# EAGLE board arduino_olfactometer (EAGLE 5.11)
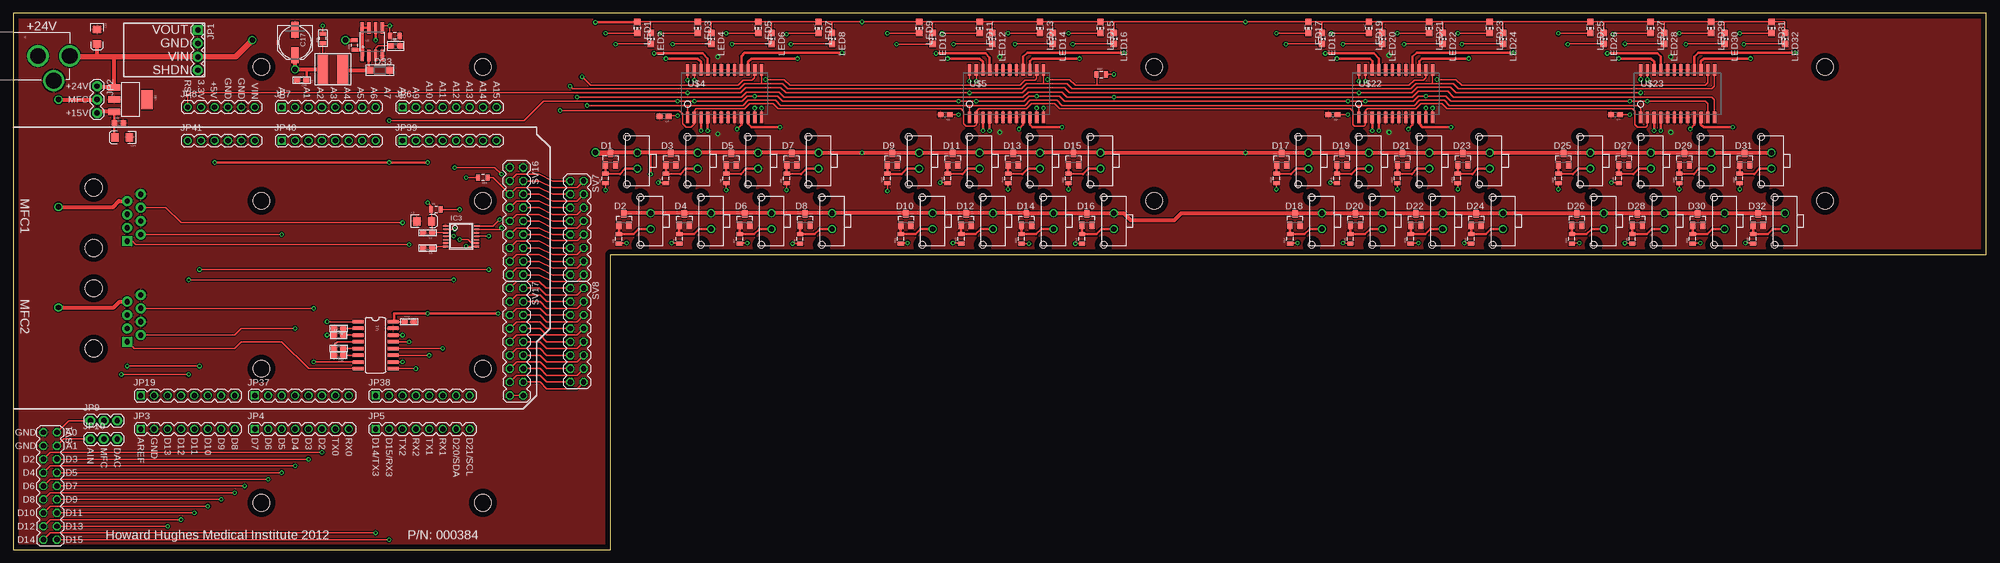
[diagram p4: board, top side]
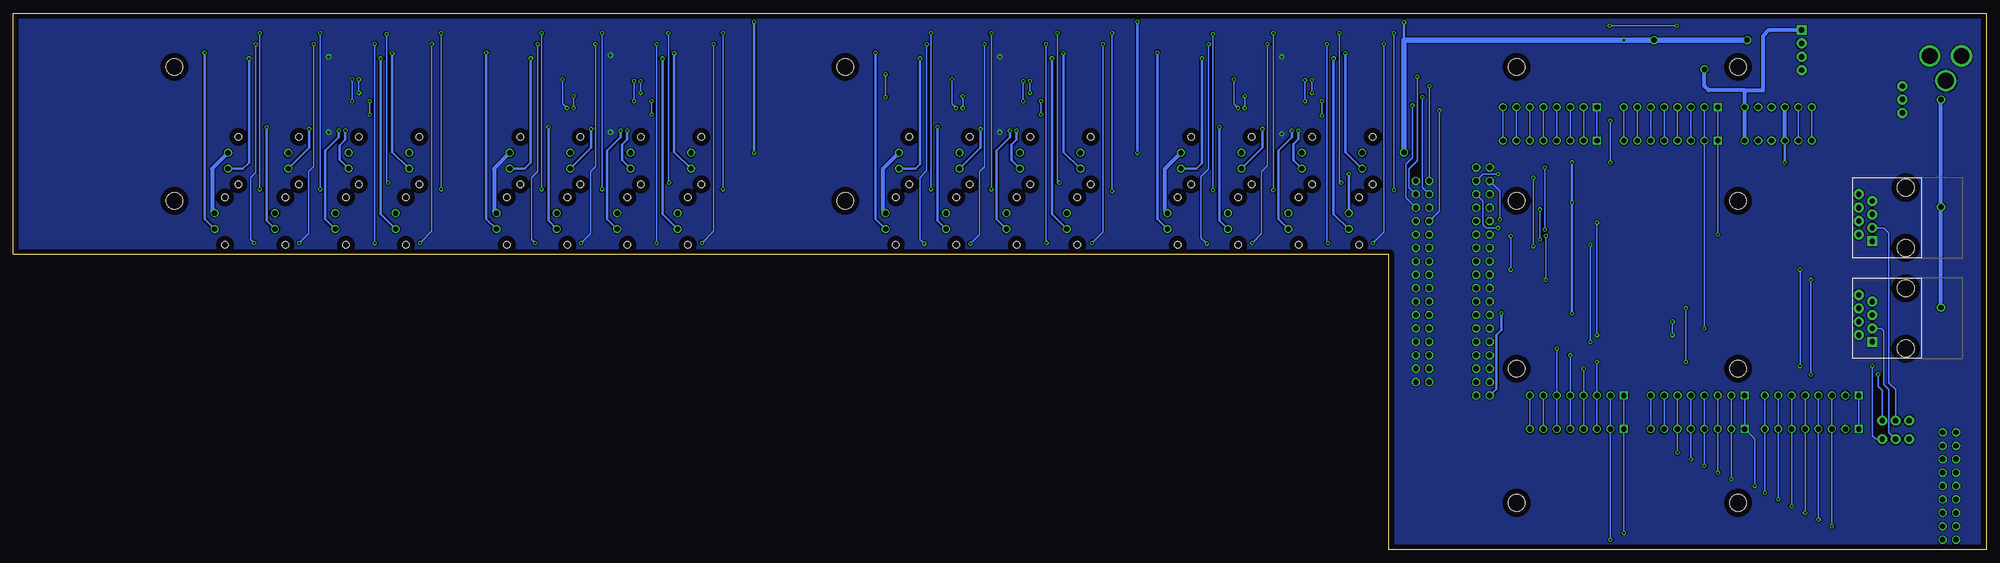
[diagram p5: board, bottom side, seen from below]

Size 373.38 x 101.6 mm. Coordinates in mm from the lower left corner, seen from the top.
Outline: 0,0 113.03,0 113.03,55.88 373.38,55.88 373.38,101.6 0,101.6 0,0
Copper layers (1*16): Top 0.035mm / dielectric 1.5mm / Bottom 0.035mm
Design rules "default *": minimum track width 10mil, minimum drill 13mil, track to track 8mil, track to pad 8mil, pad to pad 8mil, via to via 8mil, smd to smd 8mil, copper to edge 40mil, drill to drill 8mil, minimum pad ring 10mil, minimum via ring 8mil, stop-mask expansion 4mil, vias tented up to drill 0mil, thermal gap 10mil
Holes 3.17 mm at 342.9,91.44 342.9,66.04 215.9,91.44 215.9,66.04 88.9,91.44 88.9,66.04 88.9,34.29 88.9,8.89 46.99,91.44 46.99,66.04 46.99,34.29 46.99,8.89

## Footprints (pad centres in the part's own frame; a part is rotated, then mirrored left to right if it is on the bottom)
0603 = smd 1.1 x 1: 1 -0.85,0; 2 0.85,0
EIA3216 = smd 1.4 x 1.6: A 1.4,0; C -1.4,0
PANASONIC_D = smd 3 x 1.4: + 2.4,0; - -2.4,0
SOT23 = smd 1 x 1.4: 1 -0.95,-1.1; 2 0.95,-1.1; 3 0,1.1
SOD123 = smd 1.4 x 1.4: A 1.9,0; C -1.9,0
TSSOP14 = smd 0.305 x 0.991: 1 -1.95,-2.918; 2 -1.3,-2.918; 3 -0.65,-2.918; 4 0,-2.918; 5 0.65,-2.918; 6 1.3,-2.918; 7 1.95,-2.918; 8 1.95,2.918; 9 1.3,2.918; 10 0.65,2.918; 11 0,2.918; 12 -0.65,2.918; 13 -1.3,2.918; 14 -1.95,2.918
POWER_JACK_PTH = drill 2.997 round: GND 0,7.7; GNDBREAK 4.7,10.7; PWR 0,13.7
1X04 = drill 1.016 pad 1.88 square: 1 0,0 | drill 1.016 pad 1.88 round: 2 2.54,0; 3 5.08,0; 4 7.62,0
1X03 = drill 1.016 pad 1.88 round: 1 0,0; 2 2.54,0; 3 5.08,0
1X08 = drill 1.016 square: 1 0,0 | drill 1.016 round: 2 2.54,0; 3 5.08,0; 4 7.62,0; 5 10.16,0; 6 12.7,0; 7 15.24,0; 8 17.78,0
1X06 = drill 1.016 round: 1 0,0; 2 2.54,0; 3 5.08,0; 4 7.62,0; 5 10.16,0; 6 12.7,0
CR54 = smd 5.5 x 2.15: P$1 0,1.92; P$2 0,-1.92
CHIP-LED0805 = smd 1.2 x 1.2: A 0,-1.05; C 0,1.05
0805 = smd 0.8 x 1.2: 1 -0.9,0; 2 0.9,0
MA09-2 = drill 1.016 octagon: 1 -10.16,-1.27; 2 -10.16,1.27; 3 -7.62,-1.27; 4 -7.62,1.27; 5 -5.08,-1.27; 6 -5.08,1.27; 7 -2.54,-1.27; 8 -2.54,1.27; 9 0,-1.27; 10 0,1.27; 11 2.54,-1.27; 12 2.54,1.27; 13 5.08,-1.27; 14 5.08,1.27; 15 7.62,-1.27; 16 7.62,1.27; 17 10.16,-1.27; 18 10.16,1.27
MA08-2 = drill 1.016 octagon: 1 -8.89,-1.27; 2 -8.89,1.27; 3 -6.35,-1.27; 4 -6.35,1.27; 5 -3.81,-1.27; 6 -3.81,1.27; 7 -1.27,-1.27; 8 -1.27,1.27; 9 1.27,-1.27; 10 1.27,1.27; 11 3.81,-1.27; 12 3.81,1.27; 13 6.35,-1.27; 14 6.35,1.27; 15 8.89,-1.27; 16 8.89,1.27
SO016 = smd 0.66 x 2.032: 1 -4.445,-3.315; 2 -3.175,-3.315; 3 -1.905,-3.315; 4 -0.635,-3.315; 5 0.635,-3.315; 6 1.905,-3.315; 7 3.175,-3.315; 8 4.445,-3.315; 9 4.445,3.315; 10 3.175,3.315; 11 1.905,3.315; 12 0.635,3.315; 13 -0.635,3.315; 14 -1.905,3.315; 15 -3.175,3.315; 16 -4.445,3.315
SO08 = smd 0.61 x 2.21: 1 -1.905,-2.616; 2 -0.635,-2.616; 3 0.635,-2.616; 4 1.905,-2.616; 5 1.905,2.616; 6 0.635,2.616; 7 -0.635,2.616; 8 -1.905,2.616
RJ45-8 = drill 1 pad 1.88 square: 1 -4.445,6.35 | drill 1 pad 1.88 round: 2 -3.175,8.89; 3 -1.905,6.35; 4 -0.635,8.89; 5 0.635,6.35; 6 1.905,8.89; 7 3.175,6.35; 8 4.445,8.89 | hole 3.2: -5.715,0; 5.715,0
SOT223 = smd 1.219 x 2.235: 1 -2.311,-3.099; 2 0,-3.099; 3 2.311,-3.099 | smd 3.6 x 2.2: 4 0,3.099
SOP24 = smd 0.6 x 2.2: 1 -6.985,-4.5; 2 -5.715,-4.5; 3 -4.445,-4.5; 4 -3.175,-4.5; 5 -1.905,-4.5; 6 -0.635,-4.5; 7 0.635,-4.5; 8 1.905,-4.5; 9 3.175,-4.5; 10 4.445,-4.5; 11 5.715,-4.5; 12 6.985,-4.5; 13 6.985,4.5; 14 5.715,4.5; 15 4.445,4.5; 16 3.175,4.5; 17 1.905,4.5; 18 0.635,4.5; 19 -0.635,4.5; 20 -1.905,4.5; 21 -3.175,4.5; 22 -4.445,4.5; 23 -5.715,4.5; 24 -6.985,4.5
MOLEX-MICROFIT-2 = drill 1 round: 1 1.5,0; 2 -1.5,0 | hole 1.27: -4.5,-1.96; 4.5,-1.96

## Placement (x,y rotation side)
C1  .1uF  [0603]  78.42,60.01 180 top
C2  10uF  [EIA3216]  77.79,62.23 0 top
C3  .1uF  [0603]  78.42,57.15 180 top
C4  .1uF  [0603]  123.19,82.07 180 top
C5  .1uF  [0603]  176.37,82.39 180 top
C6  .1uF  [0603]  249.71,82.39 180 top
C7  .1uF  [0603]  303.21,82.39 180 top
C8  1uF  [0603]  61.59,40.64 0 top
C9  1uF  [0603]  61.59,38.1 0 top
C10  1uF  [0603]  61.59,36.83 180 top
C11  1uF  [0603]  61.59,41.91 180 top
C12  1uF  [0603]  74.93,43.18 0 top
C13  10uF  [EIA3216]  15.88,97.16 270 top
C14  10uF  [EIA3216]  20.64,78.11 180 top
C15  1uF  [0603]  20,80.8 0 top
C16  470pF  [0603]  72.39,95.41 0 top
C17  100uF  [PANASONIC_D]  53.34,96.04 270 top
C18  1uF  [0603]  54.61,88.9 180 top
D1  BAT54  [SOT23]  113.03,73.98 0 top
D2  BAT54  [SOT23]  115.57,62.55 0 top
D3  BAT54  [SOT23]  124.46,73.98 0 top
D4  BAT54  [SOT23]  127,62.55 0 top
D5  BAT54  [SOT23]  135.89,73.98 0 top
D6  BAT54  [SOT23]  138.43,62.55 0 top
D7  BAT54  [SOT23]  147.32,73.98 0 top
D8  BAT54  [SOT23]  149.86,62.55 0 top
D9  BAT54  [SOT23]  166.37,73.98 0 top
D10  BAT54  [SOT23]  168.91,62.55 0 top
D11  BAT54  [SOT23]  177.8,73.98 0 top
D12  BAT54  [SOT23]  180.34,62.55 0 top
D13  BAT54  [SOT23]  189.23,73.98 0 top
D14  BAT54  [SOT23]  191.77,62.55 0 top
D15  BAT54  [SOT23]  200.66,73.98 0 top
D16  BAT54  [SOT23]  203.2,62.55 0 top
D17  BAT54  [SOT23]  240.03,73.98 0 top
D18  BAT54  [SOT23]  242.57,62.55 0 top
D19  BAT54  [SOT23]  251.46,73.98 0 top
D20  BAT54  [SOT23]  254,62.55 0 top
D21  BAT54  [SOT23]  262.89,73.98 0 top
D22  BAT54  [SOT23]  265.43,62.55 0 top
D23  BAT54  [SOT23]  274.32,73.98 0 top
D24  BAT54  [SOT23]  276.86,62.55 0 top
D25  BAT54  [SOT23]  293.37,73.98 0 top
D26  BAT54  [SOT23]  295.91,62.55 0 top
D27  BAT54  [SOT23]  304.8,73.98 0 top
D28  BAT54  [SOT23]  307.34,62.55 0 top
D29  BAT54  [SOT23]  316.23,73.98 0 top
D30  BAT54  [SOT23]  318.77,62.55 0 top
D31  BAT54  [SOT23]  327.66,73.98 0 top
D32  BAT54  [SOT23]  330.2,62.55 0 top
D33  [SOD123]  69.37,90.81 0 top
IC3  AD5666  [TSSOP14]  84.77,59.37 270 top
J1  POWER_JACKPTH  [POWER_JACK_PTH]  -3.02,93.5 270 top
JP1  [1X04]  34.93,98.42 270 top
JP2  [1X03]  15.88,87.79 270 top
JP3  [1X08]  24.13,22.86 0 top
JP4  [1X08]  45.72,22.86 0 top
JP5  [1X08]  68.58,22.86 0 top
JP6  [1X08]  73.66,83.82 0 top
JP7  [1X08]  50.8,83.82 0 top
JP8  [1X06]  33.02,83.82 0 top
JP9  [1X03]  14.61,24.45 0 top
JP10  [1X03]  14.61,20.96 0 top
JP19  [1X08]  24.13,29.21 0 top
JP37  [1X08]  45.72,29.21 0 top
JP38  [1X08]  68.58,29.21 0 top
JP39  [1X08]  73.66,77.47 0 top
JP40  [1X08]  50.8,77.47 0 top
JP41  [1X06]  33.02,77.47 0 top
L1  [CR54]  60.48,90.96 90 top
LED1  [CHIP-LED0805]  118.11,98.9 180 top
LED2  [CHIP-LED0805]  120.65,96.84 180 top
LED3  [CHIP-LED0805]  129.54,98.9 180 top
LED4  [CHIP-LED0805]  132.08,96.84 180 top
LED5  [CHIP-LED0805]  140.97,98.9 180 top
LED6  [CHIP-LED0805]  143.51,96.84 180 top
LED7  [CHIP-LED0805]  152.4,98.9 180 top
LED8  [CHIP-LED0805]  154.94,96.84 180 top
LED9  [CHIP-LED0805]  171.45,98.9 180 top
LED10  [CHIP-LED0805]  173.99,96.84 180 top
LED11  [CHIP-LED0805]  182.88,98.9 180 top
LED12  [CHIP-LED0805]  185.26,96.84 180 top
LED13  [CHIP-LED0805]  194.31,98.9 180 top
LED14  [CHIP-LED0805]  196.69,96.84 180 top
LED15  [CHIP-LED0805]  205.74,98.9 180 top
LED16  [CHIP-LED0805]  208.28,96.84 180 top
LED17  [CHIP-LED0805]  245.11,98.9 180 top
LED18  [CHIP-LED0805]  247.65,96.84 180 top
LED19  [CHIP-LED0805]  256.54,98.9 180 top
LED20  [CHIP-LED0805]  259.08,96.84 180 top
LED21  [CHIP-LED0805]  267.97,98.9 180 top
LED22  [CHIP-LED0805]  270.51,96.84 180 top
LED23  [CHIP-LED0805]  279.4,98.9 180 top
LED24  [CHIP-LED0805]  281.94,96.84 180 top
LED25  [CHIP-LED0805]  298.45,98.9 180 top
LED26  [CHIP-LED0805]  300.99,96.84 180 top
LED27  [CHIP-LED0805]  309.88,98.9 180 top
LED28  [CHIP-LED0805]  312.42,96.84 180 top
LED29  [CHIP-LED0805]  321.31,98.9 180 top
LED30  [CHIP-LED0805]  323.85,96.84 180 top
LED31  [CHIP-LED0805]  332.74,98.9 180 top
LED32  [CHIP-LED0805]  335.28,96.84 180 top
R1  10K  [0805]  80.01,64.45 0 top
R2  10K  [0805]  112.08,70.33 90 top
R3  10K  [0805]  114.62,58.9 90 top
R4  10K  [0805]  123.51,70.33 90 top
R5  10K  [0805]  126.05,58.9 90 top
R6  10K  [0805]  134.94,70.33 90 top
R7  10K  [0805]  137.48,58.9 90 top
R8  10K  [0805]  146.37,70.33 90 top
R9  10K  [0805]  148.91,58.9 90 top
R10  10K  [0805]  165.42,70.33 90 top
R11  10K  [0805]  167.96,58.9 90 top
R12  10K  [0805]  176.85,70.33 90 top
R13  10K  [0805]  179.39,58.9 90 top
R14  10K  [0805]  188.28,70.33 90 top
R15  10K  [0805]  190.82,58.9 90 top
R16  10K  [0805]  199.71,70.33 90 top
R17  10K  [0805]  202.25,58.9 90 top
R18  10K  [0805]  239.08,70.33 90 top
R19  10K  [0805]  241.62,58.9 90 top
R20  10K  [0805]  250.51,70.33 90 top
R21  10K  [0805]  253.05,58.9 90 top
R22  10K  [0805]  261.94,70.33 90 top
R23  10K  [0805]  264.48,58.9 90 top
R24  10K  [0805]  273.37,70.33 90 top
R25  10K  [0805]  275.91,58.9 90 top
R26  10K  [0805]  292.42,70.33 90 top
R27  10K  [0805]  294.96,58.9 90 top
R28  10K  [0805]  303.85,70.33 90 top
R29  10K  [0805]  306.39,58.9 90 top
R30  10K  [0805]  315.28,70.33 90 top
R31  10K  [0805]  317.82,58.9 90 top
R32  10K  [0805]  326.71,70.33 90 top
R33  10K  [0805]  329.25,58.9 90 top
R34  0  [0805]  205.9,90.01 0 top
R35  [0805]  64.61,95.57 90 top
R36  1.8K  [0805]  58.58,96.84 90 top
R37  1K  [0805]  72.23,97.31 180 top
R54  0  [0805]  88.9,70.48 180 top
SV1  [MA09-2]  6.99,12.06 270 top
SV7  [MA08-2]  106.68,60.96 270 top
SV8  [MA08-2]  106.68,40.64 270 top
SV16  [MA09-2]  95.25,62.23 270 top
SV17  [MA09-2]  95.25,39.37 270 top
U1  MAX232SOIC16  [SO016]  68.58,38.73 270 top
U2  MC34063SMD  [SO08]  67.95,96.2 0 top
U$1  RJ45-8PTH  [RJ45-8]  15.24,62.86 90 bottom
U$2  RJ45-8PTH  [RJ45-8]  15.24,43.82 90 bottom
U$3  V_REG_MIC2920  [SOT223]  22.23,85.25 270 top
U$4  TLE7232G  [SOP24]  134.62,86.36 0 top
U$5  TLE7232G  [SOP24]  187.96,86.36 0 top
U$6  MOLEX-MICROFIT-2  [MOLEX-MICROFIT-2]  118.11,73.66 270 top
U$7  MOLEX-MICROFIT-2  [MOLEX-MICROFIT-2]  120.65,62.23 270 top
U$8  MOLEX-MICROFIT-2  [MOLEX-MICROFIT-2]  129.54,73.66 270 top
U$9  MOLEX-MICROFIT-2  [MOLEX-MICROFIT-2]  132.08,62.23 270 top
U$10  MOLEX-MICROFIT-2  [MOLEX-MICROFIT-2]  140.97,73.66 270 top
U$11  MOLEX-MICROFIT-2  [MOLEX-MICROFIT-2]  143.51,62.23 270 top
U$12  MOLEX-MICROFIT-2  [MOLEX-MICROFIT-2]  152.4,73.66 270 top
U$13  MOLEX-MICROFIT-2  [MOLEX-MICROFIT-2]  154.94,62.23 270 top
U$14  MOLEX-MICROFIT-2  [MOLEX-MICROFIT-2]  171.45,73.66 270 top
U$15  MOLEX-MICROFIT-2  [MOLEX-MICROFIT-2]  173.99,62.23 270 top
U$16  MOLEX-MICROFIT-2  [MOLEX-MICROFIT-2]  182.88,73.66 270 top
U$17  MOLEX-MICROFIT-2  [MOLEX-MICROFIT-2]  185.42,62.23 270 top
U$18  MOLEX-MICROFIT-2  [MOLEX-MICROFIT-2]  194.31,73.66 270 top
U$19  MOLEX-MICROFIT-2  [MOLEX-MICROFIT-2]  196.85,62.23 270 top
U$20  MOLEX-MICROFIT-2  [MOLEX-MICROFIT-2]  205.74,73.66 270 top
U$21  MOLEX-MICROFIT-2  [MOLEX-MICROFIT-2]  208.28,62.23 270 top
U$22  TLE7232G  [SOP24]  261.62,86.36 0 top
U$23  TLE7232G  [SOP24]  314.96,86.36 0 top
U$24  MOLEX-MICROFIT-2  [MOLEX-MICROFIT-2]  245.11,73.66 270 top
U$25  MOLEX-MICROFIT-2  [MOLEX-MICROFIT-2]  247.65,62.23 270 top
U$26  MOLEX-MICROFIT-2  [MOLEX-MICROFIT-2]  256.54,73.66 270 top
U$27  MOLEX-MICROFIT-2  [MOLEX-MICROFIT-2]  259.08,62.23 270 top
U$28  MOLEX-MICROFIT-2  [MOLEX-MICROFIT-2]  267.97,73.66 270 top
U$29  MOLEX-MICROFIT-2  [MOLEX-MICROFIT-2]  270.51,62.23 270 top
U$30  MOLEX-MICROFIT-2  [MOLEX-MICROFIT-2]  279.4,73.66 270 top
U$31  MOLEX-MICROFIT-2  [MOLEX-MICROFIT-2]  281.94,62.23 270 top
U$32  MOLEX-MICROFIT-2  [MOLEX-MICROFIT-2]  298.45,73.66 270 top
U$33  MOLEX-MICROFIT-2  [MOLEX-MICROFIT-2]  300.99,62.23 270 top
U$34  MOLEX-MICROFIT-2  [MOLEX-MICROFIT-2]  309.88,73.66 270 top
U$35  MOLEX-MICROFIT-2  [MOLEX-MICROFIT-2]  312.42,62.23 270 top
U$36  MOLEX-MICROFIT-2  [MOLEX-MICROFIT-2]  321.31,73.66 270 top
U$37  MOLEX-MICROFIT-2  [MOLEX-MICROFIT-2]  323.85,62.23 270 top
U$38  MOLEX-MICROFIT-2  [MOLEX-MICROFIT-2]  332.74,73.66 270 top
U$39  MOLEX-MICROFIT-2  [MOLEX-MICROFIT-2]  335.28,62.23 270 top

## Tracks (layer width: path | path; a pad name or v marks a point on that pad's centre or on a via)
+3V3
  Bottom 0.254: JP41.2 JP8.2
+5V  (via drill 0.38)
  Top 0.254: v193.68,83.66 U$5.11 | v128.91,88.9 U$4.23 | v140.34,83.66 U$4.11 | v182.25,88.74 U$5.23 | U$23.11 320.68,84.45 320.2,84.93 v309.25,84.93 v305.91,84.93 272.1,84.93 271.14,85.88 v267.33,85.88 265.91,85.88 264.95,84.93 v255.91,84.93 v252.57,84.93 198.91,84.93 197.96,85.88 v193.68,85.88 192.25,85.88 191.29,84.93 v182.25,84.93 v178.91,84.93 145.57,84.93 144.62,85.88 v140.34,85.88 138.91,85.88 137.95,84.93 v128.91,84.93 v125.73,84.93 100.33,84.93 96.68,81.28 v71.12,81.28 | v309.25,89.06 U$23.23 | v255.91,88.74 U$22.23 | v267.33,83.66 U$22.11 | C4.1 124.36,82.23 v125.73,82.23 | C5.1 v178.91,82.39 | v252.57,82.39 C6.1 | v305.91,82.39 C7.1 | SV17.17 SV17.18 | U1.16 C12.1 | IC3.3 79.29,60.02 C1.1 79.27,62.15 C2.A 79.19,64.42 R1.1 79.16,64.98 v78.42,65.72
  Top 0.508: v91.76,44.77 v78.42,44.77 72.07,44.77 72.07,43.36 U1.16 | v38.1,73.34 v71.12,73.34 v78.42,73.34
  Bottom 0.254: v193.68,85.88 v193.68,83.66 | v128.91,84.93 v128.91,88.9 | v140.34,85.88 v140.34,83.66 | v182.25,84.93 v182.25,88.74 | v309.25,84.93 v309.25,89.06 | v255.91,84.93 v255.91,88.74 | v267.33,85.88 v267.33,83.66 | v125.73,84.93 v125.73,82.23 | v178.91,82.39 v178.91,84.93 | v252.57,84.93 v252.57,82.39 | v305.91,84.93 v305.91,82.39 | v71.12,81.28 v71.12,73.34
  Bottom 0.508: SV17.17 92.71,30.48 92.71,40.64 91.76,41.59 v91.76,44.77 | v78.42,73.34 v78.42,65.72 v78.42,44.77 | v38.1,73.34 JP41.3
  Bottom 0.762: JP41.3 JP8.3
+15V
  Top 0.508: U$3.3 19.15,82.91 C15.1 19.15,78.19 C14.A
  Top 0.762: U$3.3 16.1,82.94 JP2.3
AD2
  Bottom 0.254: JP40.3 JP7.3
AD3
  Bottom 0.254: JP40.4 JP7.4
AD4
  Bottom 0.254: JP40.5 JP7.5
AD5
  Bottom 0.254: JP40.6 JP7.6
AD6
  Bottom 0.254: JP40.7 JP7.7
AD7
  Bottom 0.254: JP40.8 JP7.8
AD8
  Bottom 0.254: JP39.1 JP6.1
AD9
  Bottom 0.254: JP39.2 JP6.2
AD10
  Bottom 0.254: JP39.3 JP6.3
AD11
  Bottom 0.254: JP39.4 JP6.4
AD12
  Bottom 0.254: JP39.5 JP6.5
AD13
  Bottom 0.254: JP39.6 JP6.6
AD14
  Bottom 0.254: JP39.7 JP6.7
AD15
  Bottom 0.254: JP39.8 JP6.8
AOUT0  (via drill 0.38)
  Top 0.254: v20.48,33.18 v33.18,33.18 | v33.18,51.12 v83.34,51.12 | v83.34,59.37 IC3.4
  Bottom 0.254: JP9.3 19.68,30.16 20.48,30.96 v20.48,33.18 | v33.18,33.18 v33.18,51.12 | v83.34,51.12 v83.34,59.37
AOUT1  (via drill 0.38)
  Top 0.254: v21.59,34.77 v35.24,34.77 | v35.24,53.02 v90.01,53.02 | v90.01,59.37 IC3.11
  Bottom 0.254: JP10.3 20.95,20.95 21.59,21.59 v21.59,34.77 | v35.24,34.77 v35.24,53.02 | v90.01,53.02 v90.01,59.37
AREF
  Bottom 0.254: JP3.1 JP19.1
D22
  Top 0.254: SV17.15 95.25,33.02 99.69,33.02 100.97,31.75 SV8.15
D23
  Top 0.254: SV17.16 99.69,31.75 100.97,30.48 106.68,30.48 SV8.16
D24
  Top 0.254: SV17.13 95.25,35.56 99.69,35.56 100.97,34.29 SV8.13
D25
  Top 0.254: SV17.14 99.69,34.29 100.97,33.02 106.68,33.02 SV8.14
D26
  Top 0.254: SV17.11 95.25,38.1 99.69,38.1 100.97,36.83 SV8.11
D27
  Top 0.254: SV17.12 99.69,36.83 100.97,35.56 106.68,35.56 SV8.12
D28
  Top 0.254: SV17.9 95.25,40.64 99.69,40.64 100.97,39.37 SV8.9
D29
  Top 0.254: SV17.10 99.69,39.37 100.97,38.1 106.68,38.1 SV8.10
D30
  Top 0.254: SV17.7 95.25,43.18 99.69,43.18 100.97,41.91 SV8.7
D31
  Top 0.254: SV17.8 99.69,41.91 100.97,40.64 106.68,40.64 SV8.8
D32
  Top 0.254: SV17.5 95.25,45.72 99.69,45.72 100.97,44.45 SV8.5
D33
  Top 0.254: SV17.6 99.69,44.45 100.97,43.18 106.68,43.18 SV8.6
D34
  Top 0.254: SV17.3 95.25,48.26 99.69,48.26 100.97,46.99 SV8.3
D35
  Top 0.254: SV17.4 99.69,46.99 100.97,45.72 106.68,45.72 SV8.4
D36
  Top 0.254: SV17.1 95.25,50.8 99.54,50.8 100.81,49.53 SV8.1
D37
  Top 0.254: SV17.2 99.54,49.53 100.81,48.26 106.68,48.26 SV8.2
D38
  Top 0.254: SV16.17 95.25,53.34 99.54,53.34 102.08,52.07 SV7.15
D39
  Top 0.254: SV16.18 99.54,52.07 102.08,50.8 106.68,50.8 SV7.16
D40
  Top 0.254: SV16.15 95.25,55.88 99.54,55.88 102.08,54.61 SV7.13
D41
  Top 0.254: SV16.16 99.54,54.61 102.08,53.34 106.68,53.34 SV7.14
D42
  Top 0.254: SV16.13 95.25,58.42 99.54,58.42 102.08,57.15 SV7.11
D43
  Top 0.254: SV16.14 99.54,57.15 102.08,55.88 106.68,55.88 SV7.12
D44
  Top 0.254: SV16.11 95.25,60.96 99.54,60.96 102.08,59.69 SV7.9
D45
  Top 0.254: SV16.12 99.69,59.69 102.08,58.58 106.84,58.58 SV7.10
D47
  Top 0.254: SV16.10 99.54,62.23 102.08,60.96 106.68,60.96 SV7.8
GND  (via drill 0.51)
  other vias: 133.35,78.74 133.35,93.34 186.69,93.34 186.69,79.06 260.35,79.06 260.35,93.66 313.69,93.34 313.69,79.06
  pour Top: 0,0 0,101.6 373.38,101.6 373.38,55.88 113.03,55.88 113.03,0
  pour Bottom: 0,0 0,101.6 373.38,101.6 373.38,55.88 113.03,55.88 113.03,0
MFC1-AIN
  Bottom 0.254: JP9.2 17.14,30.32 18.41,31.59 18.41,60.01 19.37,60.96 U$1.3
MFC1-AOUT  (via drill 0.38)
  Top 0.254: U$1.2 | U$1.2 v50.8,59.69
  Bottom 0.254: JP7.1 JP40.1 v50.8,59.69
MFC1-RXD  (via drill 0.38)
  Top 0.254: U$1.6 | U$1.6 28.89,64.77 31.75,61.91 v73.66,61.91 | v73.66,40.64 U1.14
  Bottom 0.254: v73.66,61.91 v73.66,40.64
MFC1-TXD  (via drill 0.38)
  Top 0.254: U$1.1 22.54,58.42 23.18,57.78 v74.93,57.78 | v74.93,39.37 U1.13
  Bottom 0.254: v74.93,57.78 v74.93,39.37
MFC2-AIN
  Bottom 0.254: JP10.2 18.41,22.23 18.41,30.32 19.37,31.27 19.37,41.43 19.84,41.91 U$2.3 | U$2.3
MFC2-AOUT  (via drill 0.38)
  Top 0.254: U$2.2 41.91,40.64 43.18,41.91 v53.34,41.91
  Bottom 0.254: JP7.2 JP40.2 v53.34,41.91
MFC2-RXD  (via drill 0.38)
  Top 0.254: U$2.6 | U$2.6 v56.83,45.72 | v56.83,35.56 U1.7
  Bottom 0.254: v56.83,45.72 v56.83,35.56
MFC2-TXD
  Top 0.254: U$2.1 22.86,38.1 41.91,38.1 43.18,39.37 50.8,39.37 55.88,34.29 U1.8
MISO  (via drill 0.38)
  Top 0.254: U$23.12 321.94,85.25 321.47,85.72 272.57,85.72 271.46,86.84 265.91,86.84 264.8,85.72 v208.28,85.72 199.39,85.72 198.44,86.68 192.09,86.68 191.13,85.72 145.89,85.72 144.94,86.68 138.75,86.68 137.79,85.72 v106.68,85.72 | v208.28,90.01 R34.2 | SV7.3 102.08,67.31 99.54,68.58 95.25,68.58 SV16.5 90.81,70.48 R54.1
  Bottom 0.254: v208.28,85.72 v208.28,90.01 | SV7.3 106.68,68.58 v106.68,85.72
MOSI  (via drill 0.38)
  Top 0.254: U$4.14 140.34,89.38 139.86,88.9 138.11,88.9 137.16,87.95 109.22,87.95 v107.63,89.53 | SV16.6 99.54,67.31 102.08,66.04 106.68,66.04 SV7.4 | v92.39,60.96 92.11,60.67 IC3.13
  Bottom 0.254: SV16.6 95.25,66.04 95.25,61.59 94.61,60.96 v92.39,60.96 | v107.63,89.53 107.63,73.66 109.22,72.07 109.22,68.58 SV7.4
N$1  (via drill 0.38)
  Top 0.254: R1.2 v84.45,64.45 | v84.45,58.74 86.04,58.74 86.71,58.07 IC3.9
  Bottom 0.254: v84.45,64.45 v84.45,58.74
N$2
  Top 0.254: C8.2 U1.3
N$3  (via drill 0.38)
  Top 0.254: v141.6,83.66 U$4.12 | v142.4,89.06 145.89,89.06 147,87.95 190.5,87.95 191.45,88.9 193.36,88.9 193.68,89.22 U$5.14
  Bottom 0.254: v141.6,83.66 142.4,84.45 v142.4,89.06
N$4  (via drill 0.38)
  Top 0.508: D1.1 R2.2 114.83,71.18 115.82,72.16 U$6.1 | v121.28,93.98 130.49,93.98 131.44,93.03 U$4.21
  Bottom 0.508: U$6.1 121.28,75.33 v121.28,93.98
N$5  (via drill 0.38)
  Top 0.254: v112.08,68.1 R2.1 | v112.08,97.79 112.14,97.85 LED1.C
  Bottom 0.254: v112.08,68.1 v112.08,97.79
N$6  (via drill 0.38)
  Top 0.508: D2.1 R3.2 117.37,59.75 118.36,60.73 U$7.1 | v123.51,93.03 129.54,93.03 130.18,92.39 U$4.22
  Bottom 0.508: U$7.1 123.51,63.59 v123.51,93.03
N$7  (via drill 0.38)
  Top 0.508: D3.1 R4.2 126.26,71.18 127.25,72.16 U$8.1 | v130.18,79.38 U$4.3
  Bottom 0.508: U$8.1 131.13,73.75 131.13,76.83 130.18,77.79 v130.18,79.38
N$8
  Top 0.254: IC3.7 80.28,57.42 80.01,57.15 C3.1
N$9  (via drill 0.38)
  Top 0.254: R3.1 114.67,58.1 v116.05,58.1 | v113.98,95.73 114.04,95.79 LED2.C
  Bottom 0.254: v116.05,58.1 113.98,60.17 v113.98,95.73
N$10  (via drill 0.38)
  Top 0.254: R4.1 123.45,69.53 v122.08,69.53 | v122.4,97.79 122.46,97.85 LED3.C
  Bottom 0.254: v122.08,69.53 122.4,69.85 v122.4,97.79
N$11  (via drill 0.38)
  Top 0.254: R5.1 125.99,58.1 v124.62,58.1 | v124.78,95.73 124.84,95.79 LED4.C
  Bottom 0.254: v124.62,58.1 124.78,58.26 v124.78,95.73
N$12  (via drill 0.38)
  Top 0.254: v134.94,97.79 135,97.85 LED5.C | v134.94,68.1 R6.1
  Bottom 0.254: v134.94,68.1 v134.94,97.79
N$13  (via drill 0.38)
  Top 0.254: R7.1 137.53,58.1 v138.91,58.1 | v136.05,95.73 136.11,95.79 LED6.C
  Bottom 0.254: v138.91,58.1 137.16,59.85 137.16,71.6 136.05,72.71 v136.05,95.73
N$14  (via drill 0.38)
  Top 0.508: D4.1 R5.2 128.8,59.75 129.79,60.73 U$9.1 | v131.44,79.38 U$4.4
  Bottom 0.508: U$9.1 133.99,62.63 133.99,75.56 131.44,78.11 v131.44,79.38
N$15  (via drill 0.38)
  Top 0.508: D5.1 R6.2 137.69,71.18 138.68,72.16 U$10.1 | v137,79.69 137.79,80.49 U$4.9
  Bottom 0.508: U$10.1 137,76.13 v137,79.69
N$16  (via drill 0.38)
  Top 0.508: D6.1 R7.2 140.23,59.75 141.22,60.73 U$11.1 | v145.1,80.01 139.7,80.01 139.06,80.64 U$4.10
  Bottom 0.508: U$11.1 145.1,62.32 v145.1,80.01
N$17  (via drill 0.38)
  Top 0.254: v146.37,97.63 146.59,97.85 LED7.C | v146.37,68.1 R8.1
  Bottom 0.254: v146.37,68.1 v146.37,97.63
N$18  (via drill 0.38)
  Top 0.254: R9.1 148.81,57.94 v147.48,57.94 | v147.16,95.73 147.22,95.79 LED8.C
  Bottom 0.254: v147.48,57.94 148.59,59.05 148.59,70.64 147.16,72.07 v147.16,95.73
N$19  (via drill 0.38)
  Top 0.508: D7.1 R8.2 149.12,71.18 150.11,72.16 U$12.1 | v148.43,93.03 139.7,93.03 139.06,92.39 U$4.15
  Bottom 0.508: U$12.1 149.46,72.16 148.43,73.18 v148.43,93.03
N$20  (via drill 0.38)
  Top 0.508: D8.1 R9.2 151.66,59.75 152.65,60.73 U$13.1 | U$4.16 137.79,93.5 138.43,94.14 v156.84,94.14
  Bottom 0.508: v156.84,94.14 156.84,62.63 U$13.1
N$21  (via drill 0.38)
  Top 0.254: U$22.12 v268.61,83.66 | v269.4,89.06 273.05,89.06 274.16,87.95 320.2,87.95 320.68,88.42 U$23.14
  Bottom 0.254: v268.61,83.66 269.4,84.45 v269.4,89.06
N$22  (via drill 0.38)
  Top 0.508: D9.1 R10.2 165.42,71.12 168.12,71.12 169.16,72.16 U$14.1 | v174.62,93.98 183.99,93.98 184.78,93.19 U$5.21
  Bottom 0.508: U$14.1 174.62,75.33 v174.62,93.98
N$23  (via drill 0.38)
  Top 0.508: U$15.1 171.7,60.73 170.71,59.75 R11.2 D10.1 | v176.85,93.03 182.88,93.03 183.51,92.39 U$5.22
  Bottom 0.508: U$15.1 176.85,63.59 v176.85,93.03
N$24  (via drill 0.38)
  Top 0.508: D11.1 R12.2 179.6,71.18 180.59,72.16 U$16.1 | v183.51,79.38 U$5.3
  Bottom 0.508: U$16.1 184.47,73.75 184.47,76.68 183.51,77.63 v183.51,79.38
N$25  (via drill 0.38)
  Top 0.254: v165.42,67.94 R10.1 | v165.42,97.79 165.42,97.85 LED9.C
  Bottom 0.254: v165.42,97.79 v165.42,67.94
N$26  (via drill 0.38)
  Top 0.254: R11.1 167.96,58.1 v169.23,58.1 | v167.16,95.73 173.93,95.73 LED10.C
  Bottom 0.254: v169.23,58.1 167.16,60.17 v167.16,95.73
N$27  (via drill 0.38)
  Top 0.254: R12.1 176.85,69.53 v175.42,69.53 | v175.74,97.79 175.8,97.85 LED11.C
  Bottom 0.254: v175.42,69.53 175.74,69.85 v175.74,97.79
N$28  (via drill 0.38)
  Top 0.254: R13.1 179.33,58.1 v177.8,58.1 | v177.96,95.73 178.02,95.79 LED12.C
  Bottom 0.254: v177.8,58.1 177.96,58.26 v177.96,95.73
N$29  (via drill 0.38)
  Top 0.254: v188.28,97.79 188.34,97.85 LED13.C | v188.28,68.26 R14.1
  Bottom 0.254: v188.28,68.26 v188.28,97.79
N$30  (via drill 0.38)
  Top 0.254: R15.1 190.92,57.94 v192.25,57.94 | v189.55,95.73 189.61,95.79 LED14.C
  Bottom 0.254: v192.25,57.94 190.5,59.69 190.5,71.6 189.55,72.55 v189.55,95.73
N$31  (via drill 0.38)
  Top 0.508: U$17.1 183.13,60.73 182.14,59.75 R13.2 D12.1 | v184.78,79.38 U$5.4
  Bottom 0.508: U$17.1 187.32,62.63 187.32,75.56 184.78,78.11 v184.78,79.38
N$32  (via drill 0.38)
  Top 0.508: U$18.1 192.02,72.16 191.03,71.18 R14.2 D13.1 | v190.34,79.69 191.13,80.49 U$5.9
  Bottom 0.508: U$18.1 190.34,76.13 v190.34,79.69
N$33  (via drill 0.38)
  Top 0.508: U$19.1 194.56,60.73 193.57,59.75 R15.2 D14.1 | v198.44,80.01 192.88,80.01 192.41,80.49 U$5.10
  Bottom 0.508: U$19.1 198.44,62.32 v198.44,80.01
N$34  (via drill 0.38)
  Top 0.254: R16.1 199.71,69.48 v199.71,68.26 | v199.71,97.79 199.71,97.85 LED15.C
  Bottom 0.254: v199.71,68.26 v199.71,97.79
N$35  (via drill 0.38)
  Top 0.254: R17.1 202.25,57.94 v200.98,57.94 | v200.5,95.73 200.56,95.79 LED16.C
  Bottom 0.254: v200.98,57.94 201.77,58.74 201.77,70.48 200.5,71.75 v200.5,95.73
N$36  (via drill 0.38)
  Top 0.508: U$20.1 203.45,72.16 202.46,71.18 R16.2 D15.1 | v201.77,93.03 192.88,93.03 192.41,92.55 U$5.15
  Bottom 0.508: v201.77,93.03 201.77,73.03 202.64,72.16 U$20.1
N$37  (via drill 0.38)
  Top 0.508: U$21.1 205.99,60.73 205,59.75 R17.2 D16.1 | v210.19,94.14 191.93,94.14 191.13,93.34 U$5.16
  Bottom 0.508: U$21.1 210.19,62.63 v210.19,94.14
N$38  (via drill 0.38)
  Top 0.508: D17.1 R18.2 241.83,71.18 242.82,72.16 U$24.1 | v248.28,93.98 257.49,93.98 258.44,93.03 U$22.21
  Bottom 0.508: U$24.1 248.28,75.33 v248.28,93.98
N$39  (via drill 0.38)
  Top 0.508: D18.1 R19.2 244.37,59.75 245.36,60.73 U$25.1 | v250.51,93.03 256.7,93.03 257.18,92.55 U$22.22
  Bottom 0.508: U$25.1 250.51,63.59 v250.51,93.03
N$40  (via drill 0.38)
  Top 0.508: D19.1 250.51,71.18 R20.2 253.26,71.18 254.25,72.16 U$26.1 | v257.18,79.38 U$22.3
  Bottom 0.508: U$26.1 258.13,73.75 258.13,76.68 257.18,77.63 v257.18,79.38
N$41  (via drill 0.38)
  Top 0.254: v239.08,68.26 R18.1 | v239.08,97.79 239.14,97.85 LED17.C
  Bottom 0.254: v239.08,68.26 v239.08,97.79
N$42  (via drill 0.38)
  Top 0.254: R19.1 241.62,58.1 v243.05,58.1 | v240.82,95.73 240.82,95.79 LED18.C
  Bottom 0.254: v243.05,58.1 240.82,60.33 v240.82,95.73
N$43  (via drill 0.38)
  Top 0.254: R20.1 250.51,69.53 v249.24,69.53 | v249.4,97.79 249.4,97.85 LED19.C
  Bottom 0.254: v249.24,69.53 249.4,69.69 v249.4,97.79
N$44  (via drill 0.38)
  Top 0.254: R21.1 251.62,58.05 v251.62,58.1 | v251.62,95.73 251.62,95.79 LED20.C
  Bottom 0.254: v251.62,58.1 v251.62,95.73
N$45  (via drill 0.38)
  Top 0.254: 261.94,69.53 R22.1 v261.94,68.26 | v261.94,97.79 261.94,97.85 LED21.C
  Bottom 0.254: v261.94,68.26 v261.94,97.79
N$46  (via drill 0.38)
  Top 0.254: R23.1 264.48,58.1 v265.91,58.1 | v263.21,95.73 263.21,95.79 LED22.C
  Bottom 0.254: v265.91,58.1 264.16,59.85 264.16,71.6 263.21,72.55 v263.21,95.73
N$47  (via drill 0.38)
  Top 0.508: D20.1 R21.2 255.8,59.75 256.79,60.73 U$27.1 | v258.44,79.38 U$22.4
  Bottom 0.508: U$27.1 260.99,62.63 260.99,75.56 258.44,78.11 v258.44,79.38
N$48  (via drill 0.38)
  Top 0.508: D21.1 261.94,71.18 R22.2 264.69,71.18 265.68,72.16 U$28.1 | v264,79.69 264.8,80.49 U$22.9
  Bottom 0.508: v264,79.69 264,76.12 264.01,76.12 U$28.1
N$49  (via drill 0.38)
  Top 0.508: D22.1 R23.2 267.23,59.75 268.22,60.73 U$29.1 | v272.1,80.01 266.7,80.01 266.06,80.64 U$22.10
  Bottom 0.508: U$29.1 272.1,62.32 v272.1,80.01
N$50  (via drill 0.38)
  Top 0.254: v273.37,68.26 R24.1 | v273.37,97.79 273.37,97.85 LED23.C
  Bottom 0.254: v273.37,68.26 v273.37,97.79
N$51  (via drill 0.38)
  Top 0.254: R25.1 275.91,58.1 v274.64,58.1 | v274.16,95.73 274.16,95.79 LED24.C
  Bottom 0.254: v274.64,58.1 275.27,58.74 275.27,70.48 274.16,71.6 v274.16,95.73
N$52  (via drill 0.38)
  Top 0.508: D23.1 273.37,71.18 R24.2 276.12,71.18 277.11,72.16 U$30.1 | v275.43,93.03 266.54,93.03 266.06,92.55 U$22.15
  Bottom 0.508: U$30.1 276.61,72.16 275.43,73.34 v275.43,93.03
N$53  (via drill 0.38)
  Top 0.508: U$31.1 279.65,60.73 278.66,59.75 R25.2 275.91,59.75 D24.1 | v283.85,94.14 265.59,94.14 264.8,93.34 U$22.16
  Bottom 0.508: U$31.1 283.85,62.63 v283.85,94.14
N$54  (via drill 0.38)
  Top 0.508: D25.1 292.42,71.18 R26.2 295.17,71.18 296.16,72.16 U$32.1 | v301.62,93.98 311.15,93.98 311.79,93.34 U$23.21
  Bottom 0.508: U$32.1 301.62,75.33 v301.62,93.98
N$55  (via drill 0.38)
  Top 0.508: D26.1 294.96,59.75 R27.2 297.71,59.75 298.7,60.73 U$33.1 | v303.85,93.03 309.88,93.03 310.51,92.39 U$23.22
  Bottom 0.508: U$33.1 303.85,63.59 v303.85,93.03
N$56  (via drill 0.38)
  Top 0.508: D27.1 303.85,71.18 R28.2 306.6,71.18 307.59,72.16 U$34.1 | v310.51,79.38 U$23.3
  Bottom 0.508: U$34.1 311.63,73.91 311.63,76.52 310.51,77.63 v310.51,79.38
N$57  (via drill 0.38)
  Top 0.254: v292.42,68.26 R26.1 | v292.42,97.79 292.42,97.85 LED25.C
  Bottom 0.254: v292.42,68.26 v292.42,97.79
N$58  (via drill 0.38)
  Top 0.254: R27.1 294.96,58.1 v296.39,58.1 | v294.16,95.73 294.16,95.79 LED26.C
  Bottom 0.254: v296.39,58.1 294.16,60.33 v294.16,95.73
N$59  (via drill 0.38)
  Top 0.254: R28.1 303.85,69.53 v302.42,69.53 | v302.74,97.63 302.74,97.85 LED27.C
  Bottom 0.254: v302.42,69.53 302.74,69.85 v302.74,97.63
N$60  (via drill 0.38)
  Top 0.254: R29.1 v304.96,58.05 | v304.96,95.79 LED28.C
  Bottom 0.254: v304.96,58.05 v304.96,95.79
N$61  (via drill 0.38)
  Top 0.254: 315.28,69.53 R30.1 v315.28,68.26 | v315.28,97.79 315.28,97.85 LED29.C
  Bottom 0.254: v315.28,68.26 v315.28,97.79
N$62  (via drill 0.38)
  Top 0.254: R31.1 317.82,58.1 v319.25,58.1 | v316.55,95.73 316.55,95.79 LED30.C
  Bottom 0.254: v319.25,58.1 317.5,59.85 317.5,71.6 316.55,72.55 v316.55,95.73
N$63  (via drill 0.38)
  Top 0.508: D28.1 306.39,59.75 R29.2 309.14,59.75 310.13,60.73 U$35.1 | v311.79,79.38 U$23.4
  Bottom 0.508: U$35.1 314.32,62.63 314.32,75.56 311.79,78.11 v311.79,79.38
N$64  (via drill 0.38)
  Top 0.508: D29.1 315.28,71.18 R30.2 318.03,71.18 319.02,72.16 U$36.1 | v317.34,79.69 318.13,80.49 U$23.9
  Bottom 0.508: U$36.1 317.34,76.13 v317.34,79.69
N$65  (via drill 0.38)
  Top 0.508: D30.1 317.82,59.75 R31.2 320.57,59.75 321.56,60.73 U$37.1 | v325.44,80.01 319.88,80.01 319.4,80.49 U$23.10
  Bottom 0.508: U$37.1 325.44,62.32 v325.44,80.01
N$66  (via drill 0.38)
  Top 0.254: v326.71,68.26 R32.1 | v326.71,97.79 326.71,97.85 LED31.C
  Bottom 0.254: v326.71,68.26 v326.71,97.79
N$67  (via drill 0.38)
  Top 0.254: R33.1 329.25,58.1 v327.82,58.1 | v327.5,95.73 327.5,95.79 LED32.C
  Bottom 0.254: v327.82,58.1 328.45,58.74 328.45,70.48 327.5,71.44 v327.5,95.73
N$68  (via drill 0.38)
  Top 0.508: D31.1 326.71,71.18 R32.2 329.46,71.18 330.45,72.16 U$38.1 | v328.77,93.03 319.88,93.03 319.4,92.55 U$23.15
  Bottom 0.508: U$38.1 329.95,72.16 328.77,73.34 v328.77,93.03
N$69  (via drill 0.38)
  Top 0.508: D32.1 329.25,59.75 R33.2 332,59.75 332.99,60.73 U$39.1 | v337.19,94.14 318.93,94.14 318.13,93.34 U$23.16
  Bottom 0.508: U$39.1 337.19,62.63 v337.19,94.14
N$70  (via drill 0.38)
  Top 0.254: C8.1 v59.37,40.64 | v59.37,43.18 U1.1
  Bottom 0.254: v59.37,40.64 v59.37,43.18
N$71
  Top 0.254: C9.1 60.74,38.84 61.28,39.37 U1.4
N$72
  Top 0.254: C9.2 U1.5
N$73
  Top 0.254: C11.1 U1.2
N$74
  Top 0.254: C10.1 U1.6
N$76
  Top 0.254: SV1.2 10.48,24.45 JP9.1
N$77
  Top 0.254: SV1.4 9.53,20.95 JP10.1
N$78
  Top 0.508: U2.8 U2.7 | 65.93,94.67 66.04,94.77
  Top 0.762: U2.1 66.04,94.77 U2.8 | R35.1 65.93,94.67
N$81
  Top 0.508: U2.2 67.31,90.97 D33.C
  Top 0.762: D33.C 62.56,90.81 L1.P$2
N$82
  Top 0.254: U2.3 68.58,94.93 68.9,95.25 69.06,95.41 C16.1 | C16.1
N$83  (via drill 0.38)
  Top 0.254: R36.2 v58.58,99.22 | R37.2 71.28,97.37 v71.28,99.22 69.85,99.22 U2.5
  Bottom 0.254: v58.58,99.22 v71.28,99.22
N$158  (via drill 0.38)
  Top 0.254: IC3.8 86.09,57.42 v85.72,57.47 | v85.72,70.48 R54.2
  Bottom 0.254: v85.72,57.47 v85.72,70.48
NRST  (via drill 0.38)
  Top 0.254: v180.97,88.74 U$5.24 | v127.64,88.9 U$4.24 | v307.98,86.52 273.05,86.52 271.94,87.63 265.75,87.63 264.64,86.52 v254.63,86.52 199.87,86.52 198.91,87.47 191.93,87.47 190.98,86.52 v180.97,86.52 146.21,86.52 145.26,87.47 138.59,87.47 137.64,86.52 v127.64,86.52 100.33,86.52 33.5,86.52 33.02,86.04 JP8.1 | v307.98,89.06 U$23.24 | v254.63,88.74 U$22.24
  Bottom 0.254: v180.97,86.52 v180.97,88.74 | v127.64,86.52 v127.64,88.9 | v307.98,86.52 v307.98,89.06 | v254.63,86.52 v254.63,88.74 | JP8.1 JP41.1
PWM2  (via drill 0.38)
  Top 0.254: SV1.5 6.99,18.41 v58.42,18.41
  Bottom 0.254: JP37.6 JP4.6 v58.42,18.41
PWM3  (via drill 0.38)
  Top 0.254: SV1.6 v55.88,17.14
  Bottom 0.254: JP37.5 JP4.5 v55.88,17.14
PWM4  (via drill 0.38)
  Top 0.254: SV1.7 6.99,15.88 v53.34,15.88
  Bottom 0.254: JP37.4 JP4.4 v53.34,15.88
PWM5  (via drill 0.38)
  Top 0.254: SV1.8 v50.8,14.61
  Bottom 0.254: JP37.3 JP4.3 v50.8,14.61
PWM6  (via drill 0.38)
  Top 0.254: SV1.9 6.99,13.34 v48.26,13.34
  Bottom 0.254: JP37.2 JP4.2 v48.26,13.34
PWM7  (via drill 0.38)
  Top 0.254: SV1.10 v43.81,12.06
  Bottom 0.254: JP37.1 JP4.1 43.81,20.95 v43.81,12.06
PWM8  (via drill 0.38)
  Top 0.254: SV1.11 6.99,10.79 v41.91,10.79
  Bottom 0.254: JP19.8 JP3.8 v41.91,10.79
PWM9  (via drill 0.38)
  Top 0.254: SV1.12 v39.37,9.53
  Bottom 0.254: JP19.7 JP3.7 v39.37,9.53
PWM10  (via drill 0.38)
  Top 0.254: SV1.13 6.99,8.26 v36.83,8.26
  Bottom 0.254: JP19.6 JP3.6 v36.83,8.26
PWM11  (via drill 0.38)
  Top 0.254: SV1.14 v34.29,6.99
  Bottom 0.254: JP19.5 JP3.5 v34.29,6.99
PWM12  (via drill 0.38)
  Top 0.254: SV1.15 6.99,5.71 v31.75,5.71
  Bottom 0.254: JP19.4 JP3.4 v31.75,5.71
PWM13  (via drill 0.38)
  Top 0.254: SV1.16 v29.21,4.45
  Bottom 0.254: JP19.3 JP3.3 v29.21,4.45
RX0
  Bottom 0.254: JP4.8 JP37.8
RX1  (via drill 0.38)
  Top 0.254: v81.28,38.1 U1.12
  Bottom 0.254: JP5.6 JP38.6 v81.28,38.1
RX2  (via drill 0.38)
  Top 0.254: v76.2,34.29 U1.9
  Bottom 0.254: JP5.4 JP38.4 v76.2,34.29
RX3  (via drill 0.38)
  Top 0.254: SV1.18 v71.12,1.91
  Bottom 0.254: JP38.2 JP5.2 v71.12,1.91
SCK  (via drill 0.38)
  Top 0.254: 141.6,88.27 145.57,88.27 146.53,87.31 190.82,87.31 191.77,88.27 194.94,88.27 | 141.6,88.27 138.43,88.27 137.48,87.31 105.89,87.31 v105.41,87.79 | 141.6,88.27 U$4.13 | 194.94,88.27 U$5.13 | 268.61,88.27 U$22.13 | 268.61,88.27 265.43,88.27 264.48,87.31 200.34,87.31 199.39,88.27 194.94,88.27 | 268.61,88.27 272.57,88.27 273.53,87.31 321.47,87.31 321.94,87.79 U$23.13 | SV16.3 95.25,71.12 99.54,71.12 102.08,69.85 SV7.1 | IC3.14 90.85,61.32 v92.08,62.55
  Bottom 0.254: v92.08,62.55 92.08,67.94 SV16.3 | v105.41,87.79 SV7.1
SCL
  Bottom 0.254: JP5.8 JP38.8
SDA
  Bottom 0.254: JP5.7 JP38.7
SO2  (via drill 0.38)
  Top 0.254: U$5.12 v194.94,83.66 | v195.74,89.06 199.87,89.06 200.98,87.95 205.1,87.95 | 205.1,87.95 264.16,87.95 265.11,88.9 266.86,88.9 267.33,89.38 U$22.14 | R34.1 205.1,89.95 205.1,87.95
  Bottom 0.254: v194.94,83.66 195.74,84.45 v195.74,89.06
SPI-CS2
  Top 0.254: SV16.7 95.25,66.04 99.54,66.04 102.08,64.77 SV7.5
SS  (via drill 0.38)
  Top 0.254: SV16.4 99.54,69.85 102.08,68.58 106.68,68.58 SV7.2 | v92.39,71.12 91.12,72.39 v83.5,72.39 | v83.5,60.64 83.47,60.67 IC3.2
  Bottom 0.254: SV16.4 95.25,71.12 v92.39,71.12 | v83.5,60.64 v83.5,72.39
TX0
  Bottom 0.254: JP4.7 JP37.7
TX1  (via drill 0.38)
  Top 0.254: v78.74,36.83 U1.11
  Bottom 0.254: JP5.5 JP38.5 v78.74,36.83
TX2  (via drill 0.38)
  Top 0.254: v73.66,35.56 U1.10
  Bottom 0.254: JP5.3 JP38.3 v73.66,35.56
TX3  (via drill 0.38)
  Top 0.254: SV1.17 6.99,3.17 v68.58,3.17
  Bottom 0.254: JP38.1 JP5.1 v68.58,3.17
V-MFC  (via drill 1.02)
  Top 0.762: U$2.7 20.16,46.99 19.05,45.88 v8.57,45.88 | v8.57,85.25 JP2.2 | U$1.7 | U$1.7 20,66.04 18.89,64.93 v8.57,64.93
  Bottom 0.762: v8.57,45.88 v8.57,64.93 v8.57,85.25
VADR  (via drill 1.02)
  Top 0.254: R36.1 58.58,90.98 L1.P$1
  Top 0.508: C18.1 55.56,88.9 55.56,90.96
  Top 0.762: C17.+ v53.34,90.96 55.56,90.96 L1.P$1
  Bottom 0.762: JP41.6 JP8.6 45.72,87 | JP1.1 41.12,98.42 42.23,97.31 42.23,87 45.72,87 | v53.34,90.96 53.34,87.79 52.55,87 45.72,87
VD_CS  (via drill 0.38)
  Top 0.254: 127.64,84.14 U$4.1 | 127.64,84.14 v108.58,84.14 | 180.97,84.14 145.26,84.14 144.3,85.09 139.06,85.09 138.11,84.14 127.64,84.14 | U$5.1 180.97,84.14 | 180.97,84.14 | 180.97,84.14 191.45,84.14 192.41,85.09 197.49,85.09 198.44,84.14 254.63,84.14 | 254.63,84.14 U$22.1 | 254.63,84.14 265.11,84.14 266.06,85.09 270.83,85.09 271.78,84.14 307.5,84.14 307.98,83.66 U$23.1 | SV16.8 99.54,64.77 102.08,63.5 106.68,63.5 SV7.6
  Bottom 0.254: SV7.6 109.86,66.67 109.86,73.03 108.58,74.3 v108.58,84.14
VD_IN  (via drill 0.38)
  Top 0.254: U$23.2 309.25,80.33 308.93,80.01 307.34,80.01 306.86,80.49 306.86,83.03 306.39,83.5 271.3,83.5 270.35,84.45 266.38,84.45 265.43,83.5 256.22,83.5 255.91,83.19 U$22.2 255.91,80.49 255.59,80.17 253.84,80.17 253.52,80.49 253.52,83.03 253.05,83.5 197.96,83.5 197.01,84.45 192.72,84.45 191.77,83.5 182.72,83.5 182.25,83.03 U$5.2 182.25,80.49 181.93,80.17 180.34,80.17 179.86,80.64 179.86,83.03 179.39,83.5 144.78,83.5 143.83,84.45 139.38,84.45 138.43,83.5 129.22,83.5 128.91,83.19 U$4.2 128.91,80.64 128.27,80.01 127.32,80.01 126.68,80.64 126.68,82.55 126.05,83.19 v103.5,83.19 | SV16.9 95.25,63.5 99.54,63.5 102.08,62.23 SV7.7
  Bottom 0.254: v103.5,83.19 103.5,64.14 SV7.7
VIN  (via drill 0.38, 1.02)
  Top 0.254: 120.65,99.95 LED1.A | 120.65,99.95 LED3.A 132.08,99.95 | 132.08,99.95 LED5.A 143.51,99.95 | 143.51,99.95 LED7.A 154.94,99.95 | 120.65,99.95 LED2.A | 132.08,99.95 LED4.A | 143.51,99.95 LED6.A | 154.94,99.95 LED8.A | LED9.A | 154.94,99.95 v160.62,99.95 LED9.A | LED9.A 173.99,99.95 | 173.99,99.95 LED11.A 185.26,99.95 | 185.26,99.95 LED13.A 196.69,99.95 | LED14.A | 173.99,99.95 LED10.A | LED12.A | 185.26,99.95 LED12.A | 208.28,99.95 LED16.A | LED15.A 208.28,99.95 | 196.69,99.95 LED15.A | LED15.A | 196.69,99.95 LED14.A | 196.69,99.95 | LED17.A | 208.28,99.95 v233.2,99.95 LED17.A | LED17.A 247.65,99.95 | 247.65,99.95 LED19.A 259.08,99.95 | 259.08,99.95 LED21.A 270.51,99.95 | 270.51,99.95 LED23.A 281.94,99.95 | 281.94,99.95 LED25.A 300.99,99.95 | 300.99,99.95 LED27.A 312.42,99.95 | 312.42,99.95 LED29.A 323.85,99.95 | 323.85,99.95 LED31.A 335.28,99.95 LED32.A | 247.65,99.95 LED18.A | 259.08,99.95 LED20.A | 270.51,99.95 LED22.A | 281.94,99.95 LED24.A | 300.99,99.95 LED26.A | 312.42,99.95 LED28.A | 323.85,99.95 LED30.A
  Top 0.508: LED1.A 118.01,99.85 v110.17,99.85 | v120.65,71.12 120.65,75.09 | v68.58,96.52 U2.6 | R35.2
  Top 0.762: D1.3 113.11,75.16 U$6.2 124.38,75.16 D3.3 124.54,75.16 U$8.2 135.81,75.16 D5.3 135.97,75.16 U$10.2 147.24,75.16 D7.3 147.4,75.16 U$12.2 v160.66,75.16 166.29,75.16 D9.3 166.45,75.16 U$14.2 177.72,75.16 D11.3 177.88,75.16 U$16.2 189.15,75.16 D13.3 189.31,75.16 U$18.2 200.58,75.16 D15.3 200.74,75.16 U$20.2 v233.21,75.16 240.03,75.16 | D2.3 115.65,63.73 U$7.2 126.92,63.73 D4.3 127.08,63.73 U$9.2 138.35,63.73 D6.3 138.51,63.73 U$11.2 149.78,63.73 D8.3 149.94,63.73 U$13.2 168.99,63.73 | 168.99,63.73 D10.3 | 168.99,63.73 U$15.2 180.26,63.73 D12.3 180.42,63.73 U$17.2 191.69,63.73 D14.3 191.85,63.73 U$19.2 203.12,63.73 D16.3 203.28,63.73 U$21.2 210.11,63.73 211.46,62.39 219.71,62.39 221.05,63.73 242.57,63.73 | 242.57,63.73 U$25.2 254,63.73 | 254,63.73 D20.3 | 254,63.73 U$27.2 265.43,63.73 | 265.43,63.73 D22.3 | 265.43,63.73 U$29.2 276.86,63.73 | 276.86,63.73 D24.3 | 276.86,63.73 U$31.2 295.91,63.73 | 295.91,63.73 D26.3 | 295.91,63.73 U$33.2 307.34,63.73 | 307.34,63.73 D28.3 | 307.34,63.73 U$35.2 318.77,63.73 | 318.77,63.73 D30.3 | 318.77,63.73 U$37.2 330.2,63.73 | 330.2,63.73 D32.3 | 330.2,63.73 U$39.2 | 251.46,75.16 U$26.2 262.89,75.16 | 240.03,75.16 D17.3 | 240.03,75.16 U$24.2 251.46,75.16 | 251.46,75.16 D19.3 | 262.89,75.16 D21.3 | 262.89,75.16 U$28.2 274.32,75.16 | 274.32,75.16 D23.3 | 274.32,75.16 U$30.2 293.37,75.16 | 242.57,63.73 D18.3 | 293.37,75.16 D25.3 | 293.37,75.16 U$32.2 304.8,75.16 | 304.8,75.16 D27.3 | 304.8,75.16 U$34.2 316.23,75.16 | 316.23,75.16 D29.3 | 316.23,75.16 U$36.2 327.66,75.16 | 327.66,75.16 D31.3 | 327.66,75.16 U$38.2 | 19.05,93.34 19.05,87.64 U$3.1 16.1,87.56 JP2.1
  Top 0.762: 15.88,93.34 C13.A | v62.87,96.52 62.92,96.47 R35.2
  Top 1.016: J1.PWR 11.16,93.34 15.88,93.34 19.05,93.34 JP1.3 42.07,93.34 v45.24,96.52 | D1.3 | v110.17,75.25 110.33,75.09 D1.3
  Bottom 0.508: v160.62,99.95 160.62,75.16 v160.66,75.16 | v233.2,99.95 233.2,75.09 | 233.2,75.09 | v110.17,99.85 110.17,96.52 | U$7.2 v120.65,71.12
  Bottom 0.762: U$13.2 155.42,64.21 155.42,72.14 U$12.2 | U$21.2 208.76,64.21 208.76,72.14 U$20.2 | U$31.2 282.42,64.21 282.42,72.14 U$30.2 | U$39.2 335.76,64.21 335.76,72.14 U$38.2
  Bottom 1.016: v45.24,96.52 v62.87,96.52 v68.58,96.52 110.17,96.52 v110.17,75.25

## Text on the board
tPlace: VOUT | +24V | GND | VIN | SHDN | RST | 3.3V | +5V | GND | GND | A10 | A11 | A12 | A13 | A14 | A15 | +24V | VIN | A0 | A1 | A2 | A3 | A4 | A5 | A6 | A7 | A8 | A9 | MFC | +15V | MFC1 | MFC2 | GND | A0 | AREF | GND | D13 | D12 | D11 | D10 | D9 | D8 | D7 | D6 | D5 | D4 | D3 | D2 | TX0 | RX0 | D14/TX3 | D15/RX3 | TX2 | RX2 | TX1 | RX1 | D20/SDA | D21/SCL | GND | A1 | AIN | MFC | DAC | D2 | D3 | D4 | D5 | D6 | D7 | D8 | D9 | D10 | D11 | D12 | D13 | D14 | Howard Hughes Medical Institute 2012 | P/N: 000384 | D15